# EasyEDA schematic 1-Schematic_Indoor WiFi temperature sensor.json
TITLE: Sheet_1; REV: 1.0; Date: 2023-02-08; Sheet: 1/1; Drawn By: alessio.lovato.1; Company: Mittuniversittet
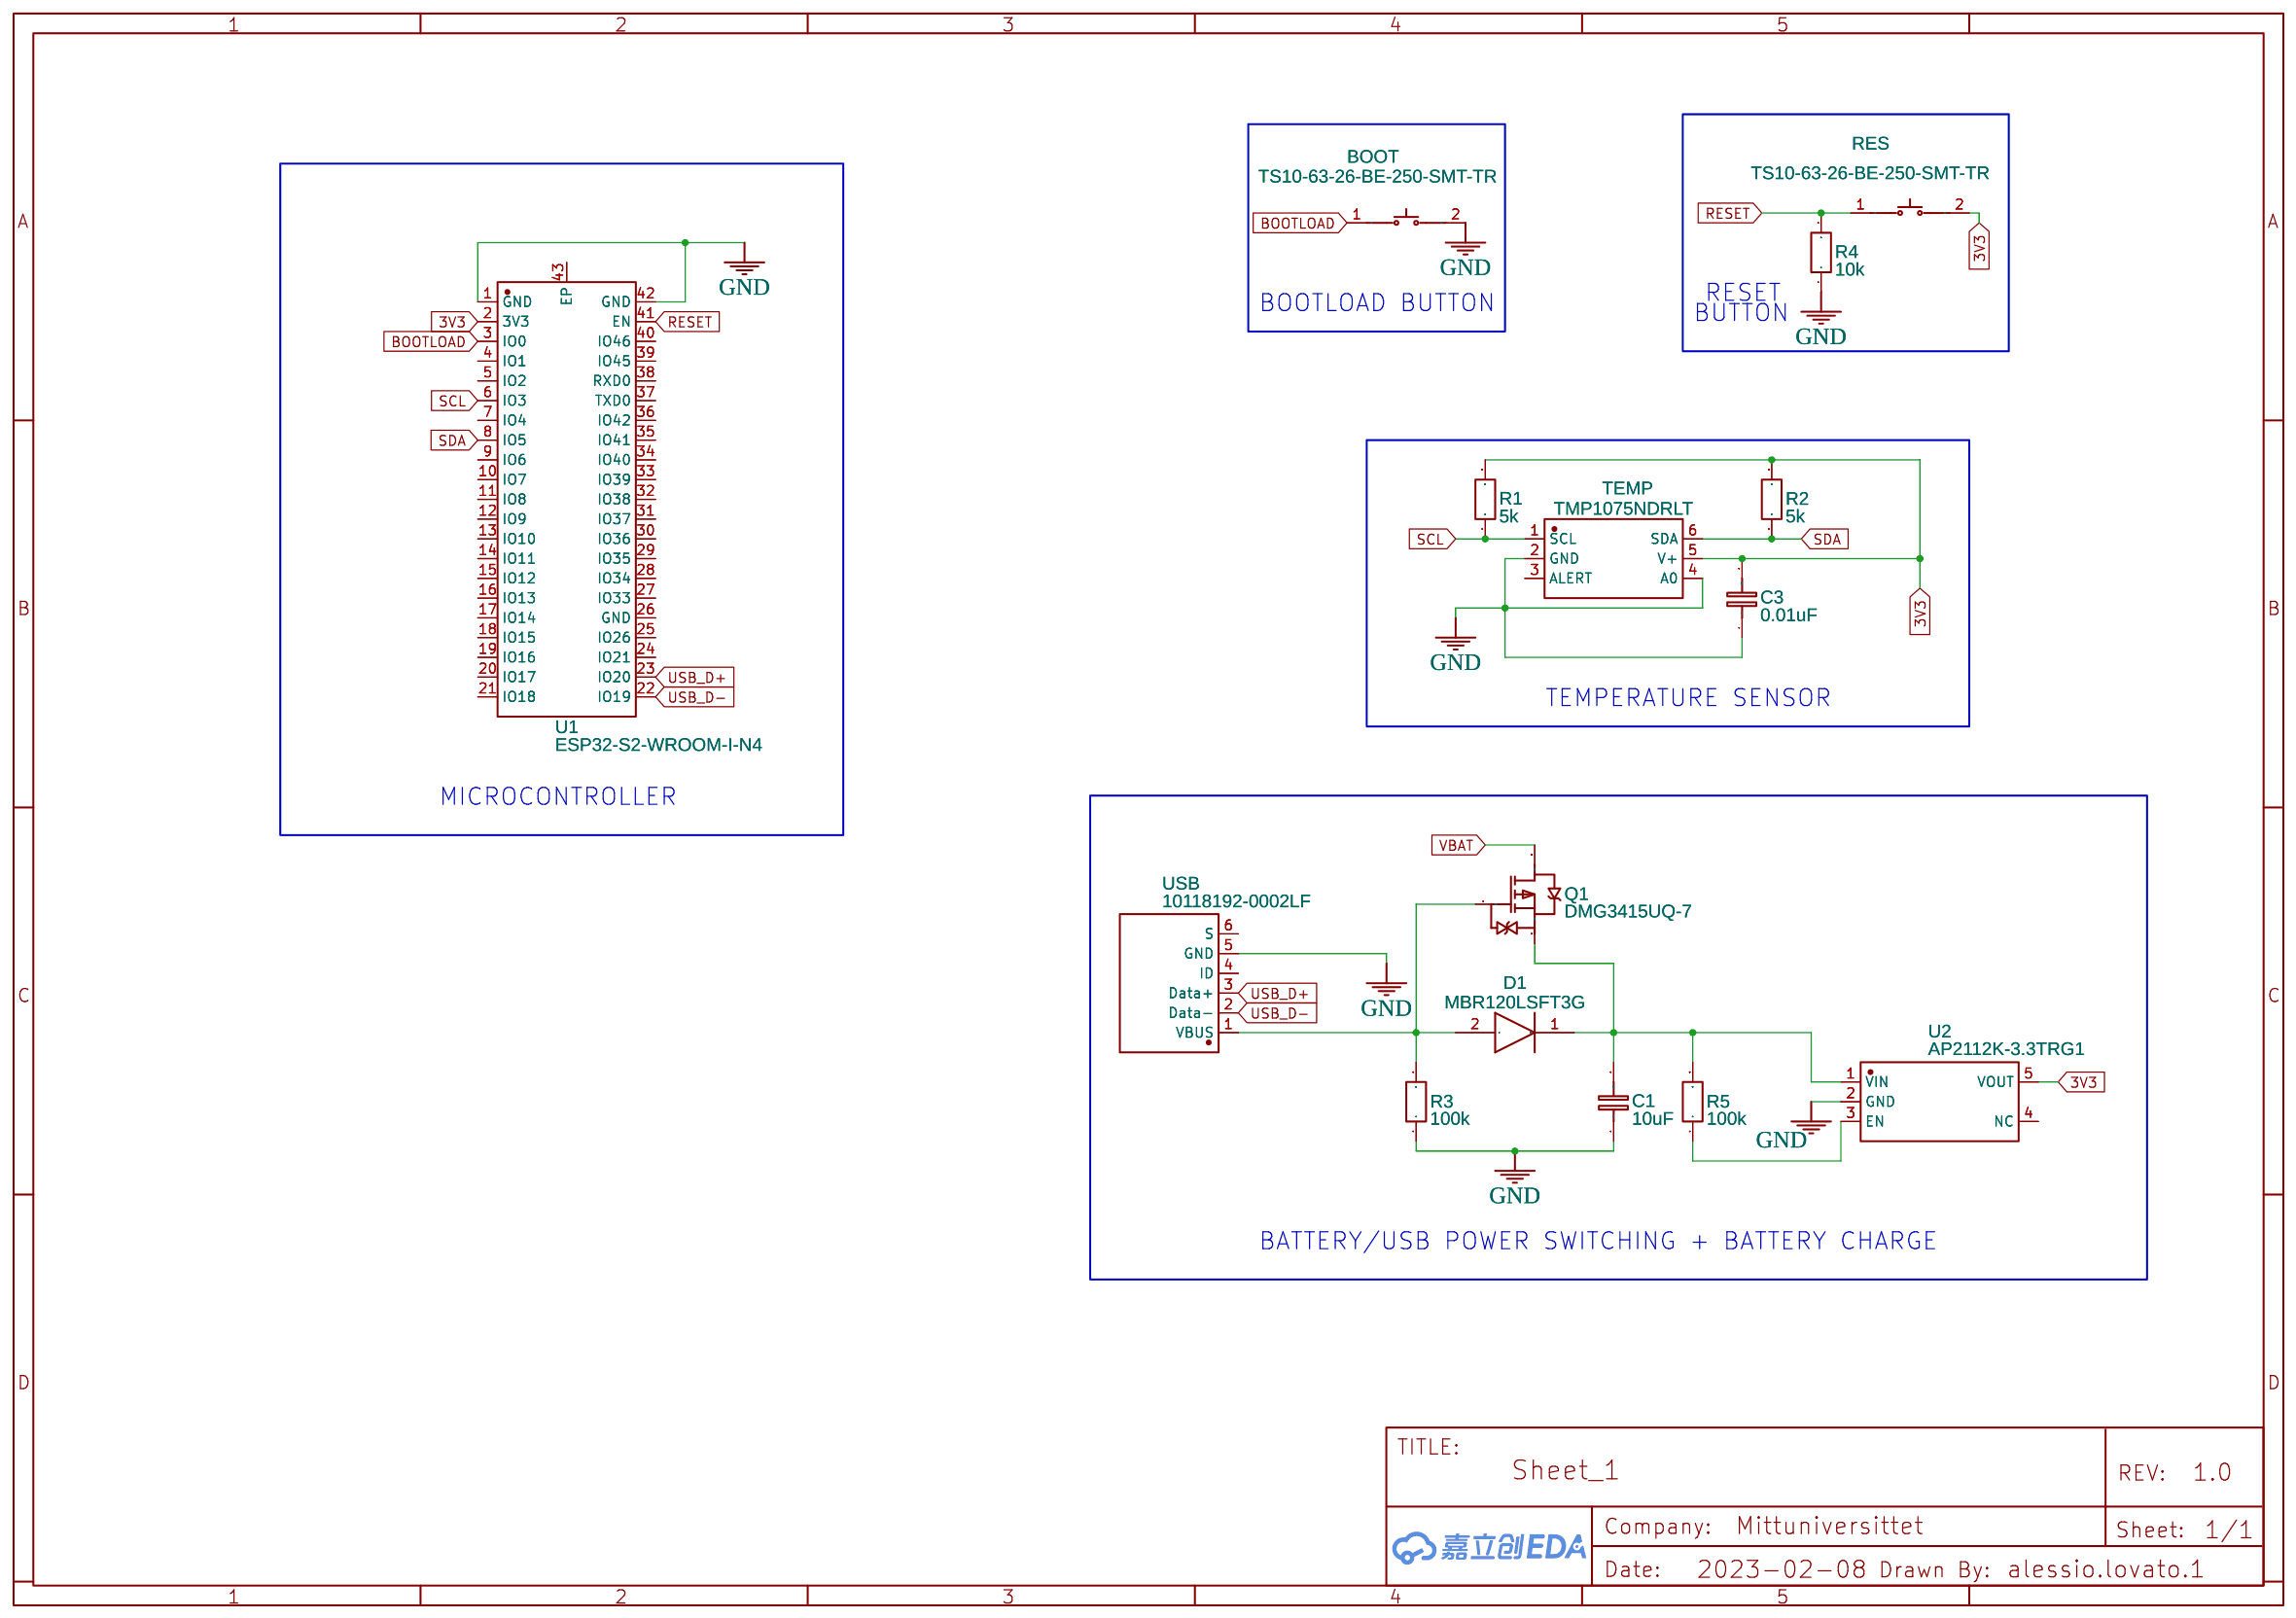
[diagram p0: schematic sheet]

## Parts
BOOT  TS10-63-26-BE-250-SMT-TR  [SW-SMD_L6.0-W3.8-LS7.4]
C1  10uF  [C0603]
C3  0.01uF  [C0603]
D1  MBR120LSFT3G  [SODFL3616X98N]
Q1  DMG3415UQ-7  [SOT-23-3_L2.9-W1.6-P1.90-LS2.8-BR]
R1  5k  [R0603]
R2  5k  [R0603]
R3  100k  [R0603]
R4  10k  [R0603]
R5  100k  [R0603]
RES  TS10-63-26-BE-250-SMT-TR  [SW-SMD_L6.0-W3.8-LS7.4]
TEMP  TMP1075NDRLT  [SOT-563-6_L1.6-W1.2-P0.5-LS1.6-BR]
U1  ESP32-S2-WROOM-I-N4  [WIFI-SMD_ESP32-S2-WROVER-I]
U2  AP2112K-3.3TRG1  [SOT-25-5_L3.0-W1.8-P0.95-LS3.0-BR]
USB  10118192-0002LF  [MICRO-USB-SMD_10118192-0002LF]

## Library data of the parts
BOOT RES = TS10-63-26-BE-250-SMT-TR: Supplier: LCSC; Supplier Part: C4364821; Manufacturer: CUI; link: https://atta.szlcsc.comnull; Contributor: lcsc
C1 C3 = C_0603_EU: Contributor: LCEDA_Lib
D1 = MBR120LSFT3G: Contributor: polishdude20
Q1 = DMG3415UQ-7: Supplier: LCSC; Supplier Part: C459537; Manufacturer: DIODES(美台); Contributor: LCSC; JLCPCB Part Class: Extended Part
R1-R5 = R_0603_EU: Contributor: LCEDA_Lib
TEMP = TMP1075NDRLT: Supplier: LCSC; Supplier Part: C3663591; Manufacturer: TI(德州仪器); Contributor: lcsc
U1 = ESP32-S2-WROOM-I-N4: Supplier: LCSC; Supplier Part: C3013911; Manufacturer: ESPRESSIF(乐鑫); link: https://atta.szlcsc.com/upload/public/pdf/source/20220705/EEF6B0DB9DD16156CC68380BA3974424.pdf; Contributor: lcsc
U2 = AP2112K-3.3TRG1: Supplier: LCSC; Manufacturer: DIODES(美台); Contributor: LCSC; Supplier Part: C51118; JLCPCB Part Class: Extended Part
USB = 10118192-0002LF: Supplier: LCSC; Supplier Part: C2972784; Manufacturer: Amphenol; link: https://atta.szlcsc.com/upload/public/pdf/source/20220304/166B174F0F5A040295CE77F99A221555.pdf; JLCPCB Part Class: Extended Part; Contributor: lcsc

## Nets
3V3: C3.2 R1.2 R2.2 RES.2 TEMP.5(V+) U1.2(3V3) U2.5(VOUT)
GND: BOOT.2 C1.1 C3.1 R3.1 R4.1 TEMP.2(GND) TEMP.4(A0) U1.1(GND) U1.42(GND) U2.2(GND) USB.5(GND)
VBAT: Q1.3(D)
BOOTLOAD: BOOT.1 U1.3(IO0)
RESET: R4.2 RES.1 U1.41(EN)
SCL: R1.1 TEMP.1(SCL) U1.6(IO3)
SDA: R2.1 TEMP.6(SDA) U1.8(IO5)
USB_D+: U1.23(IO20) USB.3(Data+)
USB_D-: U1.22(IO19) USB.2(Data-)
Net-(C1-2): C1.2 D1.1(K) Q1.2(S) R5.2 U2.1(VIN)
Net-(D1-2): D1.2(A) Q1.1(G) R3.2 USB.1(VBUS)
Net-(R5-1): R5.1 U2.3(EN)

Not connected (* = marked no-connect by the designer): TEMP 3(ALERT); U1 4(IO1) 5(IO2) 7(IO4) 9(IO6) 10(IO7) 11(IO8) 12(IO9) 13(IO10) 14(IO11) 15(IO12) 16(IO13) 17(IO14) 18(IO15) 19(IO16) 20(IO17) 21(IO18) 24(IO21) 25(IO26) 26(GND) 27(IO33) 28(IO34) 29(IO35) 30(IO36) 31(IO37) 32(IO38) 33(IO39) 34(IO40) 35(IO41) 36(IO42) 37(TXD0) 38(RXD0) 39(IO45) 40(IO46) 43(EP); U2 4(NC); USB 4(ID) 6(S)

## Notes on the sheet
- BOOTLOAD BUTTON
- BUTTON
- RESET
- TEMPERATURE SENSOR
- MICROCONTROLLER
- BATTERY/USB POWER SWITCHING + BATTERY CHARGE
